# Altium schematic sheet problem 6.SchDoc
size A; SheetNumber: 1; SheetTotal: 1
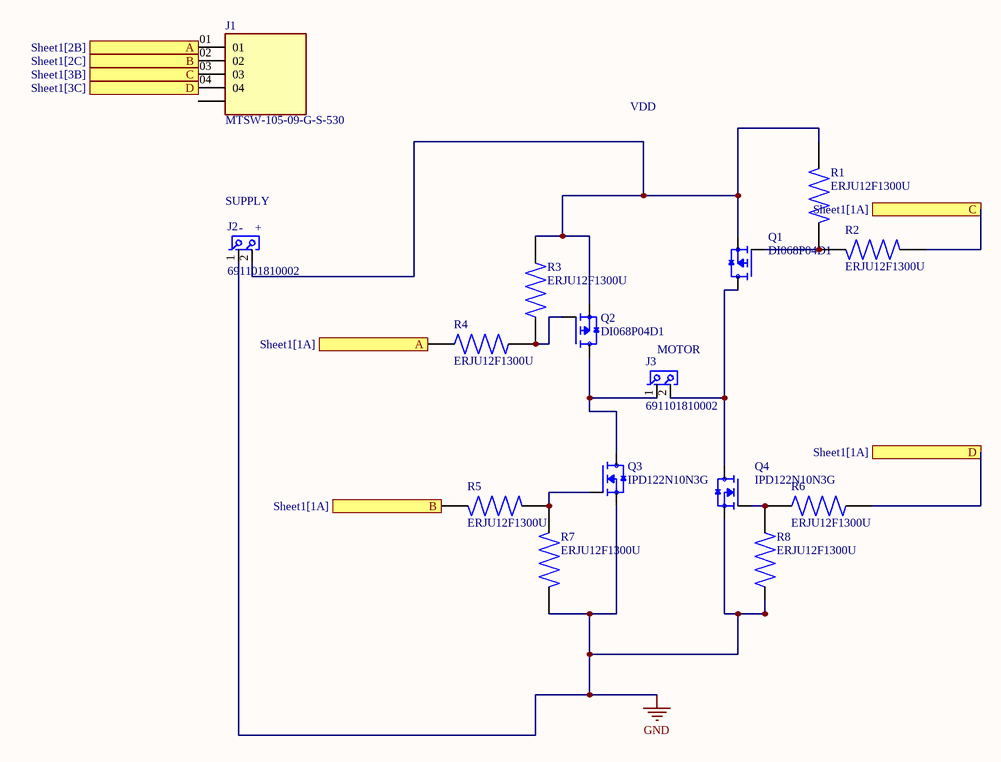
[diagram p0: problem 6.SchDoc]

## Parts
J1  MTSW-105-09-G-S-530  [SAMTEC_MTSW-105-09-G-S-530]
J2  691101810002  [691101810002]
J3  691101810002  [691101810002]
Q1  DI068P04D1  [TRANS_DI068P04D1]
Q2  DI068P04D1  [TRANS_DI068P04D1]
Q3  IPD122N10N3G  [TO252-DPAK]
Q4  IPD122N10N3G  [TO252-DPAK]
R1  ERJU12F1300U  [RES_ERJU12F1300U]
R2  ERJU12F1300U  [RES_ERJU12F1300U]
R3  ERJU12F1300U  [RES_ERJU12F1300U]
R4  ERJU12F1300U  [RES_ERJU12F1300U]
R5  ERJU12F1300U  [RES_ERJU12F1300U]
R6  ERJU12F1300U  [RES_ERJU12F1300U]
R7  ERJU12F1300U  [RES_ERJU12F1300U]
R8  ERJU12F1300U  [RES_ERJU12F1300U]

## Ports
A (see Sheet1[1A]), A (see Sheet1[2B]), B (see Sheet1[1A]), B (see Sheet1[2C]), C (see Sheet1[1A]), C (see Sheet1[3B]), D (see Sheet1[1A]), D (see Sheet1[3C])

## Nets
GND: J2.1 Q3.3(S) Q4.3(S) R7.2 R8.2
A: J1.01 R4.1 ; port A
B: J1.02 R5.1 ; port B
C: J1.03 R2.1 ; port C
D: J1.04 R6.1 ; port D
NetJ2_2: J2.2 Q1.3(S) Q2.3(S) R1.2 R3.2
NetJ3_1: J3.1 Q2.4(D) Q3.2(D)
NetJ3_2: J3.2 Q1.4(D) Q4.2(D)
NetQ1_1: Q1.1(G) R1.1 R2.2
NetQ2_1: Q2.1(G) R3.1 R4.2
NetQ3_1: Q3.1(G) R5.2 R7.1
NetQ4_1: Q4.1(G) R6.2 R8.1

Not connected (* = marked no-connect by the designer): J1 05

## Notes on the sheet
- VDD
- (near J2) SUPPLY
- (near J2) -    +
- (near J3) MOTOR

## Library data of the parts
J2 J3 = 691101810002: Serie 1018 - 10.0mm pitch - Modular THT - Blue - Horizontal cable entry Wire Protector 12.6mm height - 02p; MF: Wurth Elektronik; SnapEDA_Link: https://www.snapeda.com/parts/691101810002/Wurth+Elektronik/view-part/?ref=snap; Package: None; Value: *; MP: 691101810002; Check_prices: https://www.snapeda.com/parts/691101810002/Wurth+Elektronik/view-part/?ref=eda
Q3 Q4 = IPD122N10N3G: MOSFET Transistor, N Channel, 59 A, 100 V, 0.0105 ohm, 10 V, 2.7 V; MF: Infineon; SnapEDA_Link: https://www.snapeda.com/parts/IPD122N10N3%20G/Infineon/view-part/?ref=snap; Package: TO-252-3 Infineon; Value: *; MP: IPD122N10N3 G; Check_prices: https://www.snapeda.com/parts/IPD122N10N3%20G/Infineon/view-part/?ref=eda
J1 = MTSW-105-09-G-S-530: Package: None; MP: MTSW-105-09-G-S-530; Availability: Unavailable; Price: None; Value: *
Q1 Q2 = DI068P04D1: Package: None; Price: None; Value: *; MP: DI068P04D1; Availability: Unavailable
R1-R8 = ERJU12F1300U: Availability: Unavailable; Price: None; Package: None; MP: ERJU12F1300U; Value: *